# EAGLE design qi_pad (EAGLE 9.3.0)
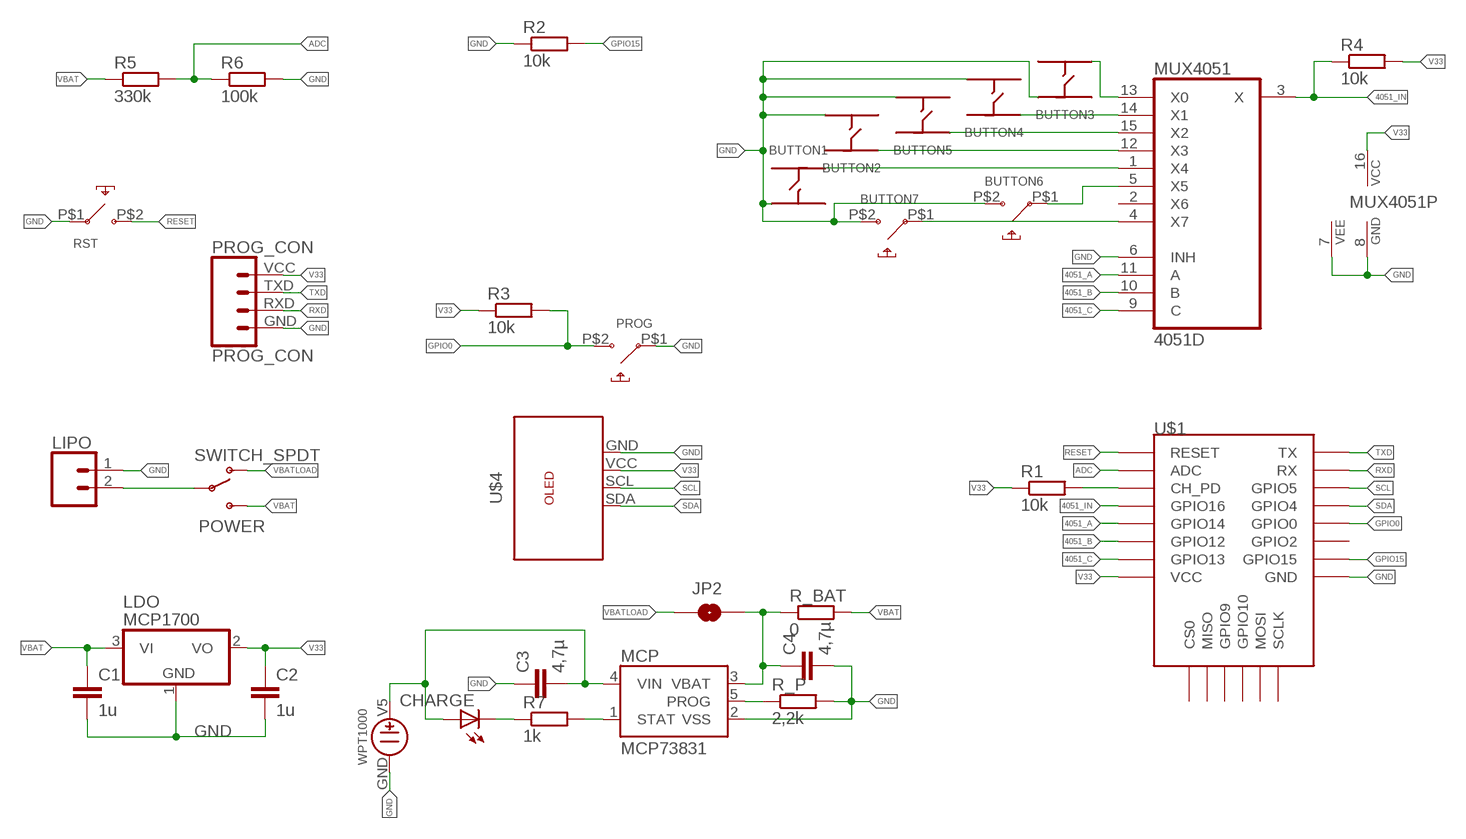
[diagram p0: schematic, sheet 1]

## Parts
BUTTON1  6X6BUTTON  [6X6BUTTON]
BUTTON2  6X6BUTTON  [6X6BUTTON]
BUTTON3  6X6BUTTON  [6X6BUTTON]
BUTTON4  6X6BUTTON  [6X6BUTTON]
BUTTON5  6X6BUTTON  [6X6BUTTON]
BUTTON6  3X4_SMD_BUTTON  [3X4BUTTON]
BUTTON7  3X4_SMD_BUTTON  [3X4BUTTON]
C1  1u  C-EUC1206  [C1206]
C2  1u  C-EUC1206  [C1206]
C3  4,7µ  C-EUC1206  [C1206]
C4  4,7µ  C-EUC1206  [C1206]
CHARGE  LEDCHIPLED_1206  [CHIPLED_1206]
JP2  JUMPER-SMT_2_NO_NO-SILK  [SMT-JUMPER_2_NO_NO-SILK]
LDO  MCP1700  MCP1703CB  [SOT23]
LIPO  CONN_02-JST-2MM-SMT  [JST-2-SMD]
MCP  MCP73831  [SOT23-5]
MUX4051  4051D  [SO16]
POWER  SWITCH_SPDT  [KPS-1290]
PROG  3X6X3,5BUTTON90  [3X6X3,5BUTTON90]
PROG_CON  PROG_CON  [PROG_CON]
R1  10k  R-EU_R0603  [R0603]
R2  10k  R-EU_R0603  [R0603]
R3  10k  R-EU_R0603  [R0603]
R4  10k  R-EU_R0603  [R0603]
R5  330k  R-EU_R0603  [R0603]
R6  100k  R-EU_R0603  [R0603]
R7  1k  R-EU_R0603  [R0603]
R_BAT  0  R-EU_R1206  [R1206]
R_P  2,2k  R-EU_R0603  [R0603]
RST  3X6X3,5BUTTON90  [3X6X3,5BUTTON90]
U$1  ESP8266-12F-SMD  [ESP8266-12F]
U$4  OLED128X64  [OLED_128X64]
WPM1000  WPT1000  [WPT1000]

## Nets
4051_A: MUX4051.11(A) U$1.GPIO14
4051_B: MUX4051.10(B) U$1.GPIO12
4051_C: MUX4051.9(C) U$1.GPIO13
4051_IN: MUX4051.3(X) R4.1 U$1.GPIO16
ADC: R5.2 R6.1 U$1.ADC
GND: BUTTON1.P1(A1) BUTTON2.P2(A2) BUTTON3.P4(U2) BUTTON4.P2(A2) BUTTON5.P2(A2) BUTTON6.P$2(P2) BUTTON7.P$2(P2) C1.2 C2.2 C3.1 C4.2 LDO.1(GND) LIPO.1 MCP.2(VSS) MUX4051.6(INH) MUX4051.7(VEE) MUX4051.8(GND) PROG.P$1(P1) PROG_CON.GND R2.1 R6.2 R_P.2 RST.P$1(P1) U$1.GND U$4.GND WPM1000.GND
GPIO0: PROG.P$2(P2) R3.2 U$1.GPIO0
GPIO15: R2.2 U$1.GPIO15
N$1: BUTTON3.P1(A1) MUX4051.13(X0)
N$2: LIPO.2 POWER.P
N$3: BUTTON6.P$1(P1) MUX4051.5(X5)
N$4: MCP.1(STAT) R7.2
N$5: R1.2 U$1.EN(CH_PD)
N$6: BUTTON7.P$1(P1) MUX4051.4(X7)
N$7: BUTTON1.P4(U2) MUX4051.1(X4)
N$8: MCP.5(PROG) R_P.1
N$9: BUTTON2.P3(U1) MUX4051.12(X3)
N$10: CHARGE.C R7.1
N$11: BUTTON5.P3(U1) MUX4051.15(X2)
N$12: BUTTON4.P3(U1) MUX4051.14(X1)
N$15: C4.1 JP2.2 MCP.3(VBAT) R_BAT.1
RESET: RST.P$2(P2) U$1.RESET
RXD: PROG_CON.RXD U$1.RXD(RX)
SCL: U$1.GPIO5 U$4.SCL
SDA: U$1.GPIO4 U$4.SDA
TXD: PROG_CON.TXD U$1.TXD(TX)
V5: C3.2 CHARGE.A MCP.4(VIN) WPM1000.V5
V33: C2.1 LDO.2(VO) MUX4051.16(VCC) PROG_CON.VCC R1.1 R3.1 R4.2 U$1.VCC U$4.VCC
VBAT: C1.1 LDO.3(VI) POWER.S R5.1 R_BAT.2
VBATLOAD: JP2.1 POWER.O
Unconnected: BUTTON1.P2(A2) BUTTON1.P3(U1) BUTTON2.P1(A1) BUTTON2.P4(U2) BUTTON3.P2(A2) BUTTON3.P3(U1) BUTTON4.P1(A1) BUTTON4.P4(U2) BUTTON5.P1(A1) BUTTON5.P4(U2) MUX4051.2(X6) U$1.CS0 U$1.GPIO2 U$1.GPIO9 U$1.GPIO10 U$1.MISO U$1.MOSI U$1.SCLK

## Library data of the parts
BUTTON1-BUTTON5 = moekoe:6X6BUTTON
BUTTON6 BUTTON7 = moekoe:3X4_SMD_BUTTON
C1-C4 = rcl:C-EU: CAPACITOR, European symbol; SPICEPREFIX: C
CHARGE = adafruit:LED: LED OSRAM: - CHIPLED LG R971, LG N971, LY N971, LG Q971, LY Q971, LO R971, LY R971 LH N974, LH R974 LS Q976, LO Q976, LY Q976 LO Q996 - Hyper CHIPLED LW Q18S LB Q993, LB Q99A, LB R99A - SideLED LS A670, LO A670, LY A670, LG A670, LP A670 LB A673, LV A673, LT A673, LW A673 LH A674 LY A675 LS A676, LA A676, LO A676, LY A676, LW A676 LS A679, LY A679, LG A679 - Hyper Micro SIDELED® LS Y876, LA Y876, LO Y876, LY Y876 LT Y87S - SmartLED LW L88C, LW L88S LB L89C, LB L89S, LG L890 LS L89K, LO L89K, LY L89K LS L896, LA L896, LO L896, LY L896 - TOPLED LS T670, LO T670, LY T670, LG T670, LP T670 LSG T670, LSP T670, LSY T670, LOP T670, LYG T670 LG T671, LOG T671, LSG T671 LB T673, LV T673, LT T673, LW T673 LH T674 LS T676, LA T676, LO T676, LY T676, LB T676, LH T676, LSB T676, LW T676 LB T67C, LV T67C, LT T67C, LS T67K, LO T67K, LY T67K, LW E67C LS E67B, LA E67B, LO E67B, LY E67B, LB E67C, LV E67C, LT E67C LW T67C LS T679, LY T679, LG T679 LS T770, LO T770, LY T770, LG T770, LP T770 LB T773, LV T773, LT T773, LW T773 LH T774 LS E675, LA E675, LY E675, LS T675 LS T776, LA T776, LO T776, LY T776, LB T776 LHGB T686 LT T68C, LB T68C - Hyper Mini TOPLED® LB M676 - Mini TOPLED Santana® LG M470 LS M47K, LO M47K, LY M47K Source: http://www.osram.convergy.de/
JP2 = SparkFun-Jumpers:JUMPER-SMT_2_NO: Normally open jumper This jumper has two pads in close proximity to each other. Apply solder to close the connection. Round pads are easier to solder for beginners, but are a lot larger. SparkFun Product that uses the round pads: SparkFun EL Sequencer <https://www.sparkfun.com/products/12781>
LDO = linear:MCP1703: 250 mA, 16V, Low Quiescent Current LDO Regulator Source: http://ww1.microchip.com/downloads/en/DeviceDoc/22049b.pdf
LIPO = SparkFun-Connectors:CONN_02: Multi connection point. Often used as Generic Header-pin footprint for 0.1 inch spaced/style header connections On any of the 0.1 inch spaced packages, you can populate with these: Break Away Headers - Straight <https://www.sparkfun.com/products/116> (PRT-00116) Break Away Male Headers - Right Angle <https://www.sparkfun.com/products/553> (PRT-00553) Female Headers <https://www.sparkfun.com/products/115> (PRT-00115) Break Away Headers - Machine Pin <https://www.sparkfun.com/products/117> (PRT-00117) Break Away Female Headers - Swiss Machine Pin <https://www.sparkfun.com/products/743> (PRT-00743) For SCREWTERMINALS and SPRING TERMINALS visit here: Screw Terimnals on SparkFun.com <https://www.sparkfun.com/search/results?term=Screw+Terminals> (5mm/3.5mm/2.54mm spacing) This device is also useful as a general connection point to wire up your design to another part of your project. Our various solder wires solder well into these plated through hole pads. Hook-Up Wire - Assortment (Stranded, 22 AWG) <https://www.sparkfun.com/products/11375> (PRT-11375) Hook-Up Wire - Assortment (Solid Core, 22 AWG) <https://www.sparkfun.com/products/11367> (PRT-11367) View the entire wire category on our website here <https://www.sparkfun.com/categories/141> Special notes: Molex polarized connector foot print use with: PRT-08233 with associated crimp pins and housings. 2.54_SCREWTERM for use with PRT-10571. 3.5mm Screw Terminal footprints for PRT-08084 5mm Screw Terminal footprints for use with PRT-08432; PROD_ID: CONN-11443
MCP = SparkFun-IC-Power:MCP73831: MCP73831T Li-Ion, Li-Pol Controller Miniature single cell, fully integrated Li-Ion, Li-polymer charge management controller Datasheet <http://ww1.microchip.com/downloads/en/DeviceDoc/20001984g.pdf> SparkFun Products: SparkFun ESP32 Thing <https://www.sparkfun.com/products/13907> SparkFun 9DoF Razor IMU M0 <https://www.sparkfun.com/products/14001>; PROD_ID: IC-09995
MUX4051 = 40xx:4051: 8-channel ANALOG MULTIPLEXER
POWER = SparkFun-Retired:SWITCH_SPDT: SWCH-10651 Side-actuated SPDT slide switch, as used on the Arduino Pro; PROD_ID: SWCH-10651
PROG RST = moekoe:3X6X3,5BUTTON90
PROG_CON = moekoe:PROG_CON
R1-R7 R_BAT R_P = rcl:R-EU_: RESISTOR, European symbol; SPICEPREFIX: R
U$1 = moekoe:ESP8266-12F-SMD
U$4 = moekoe:OLED128X64
WPM1000 = moekoe:WPT1000

## Board
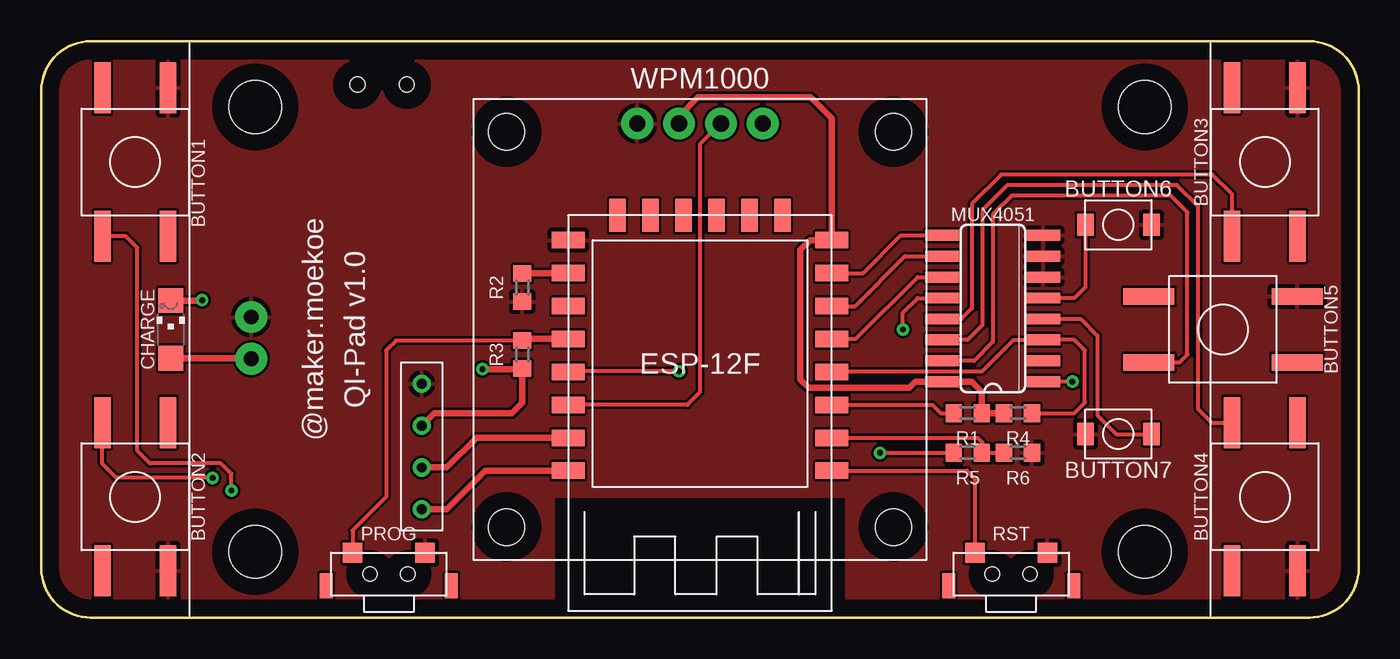
[diagram p1: board, top side]
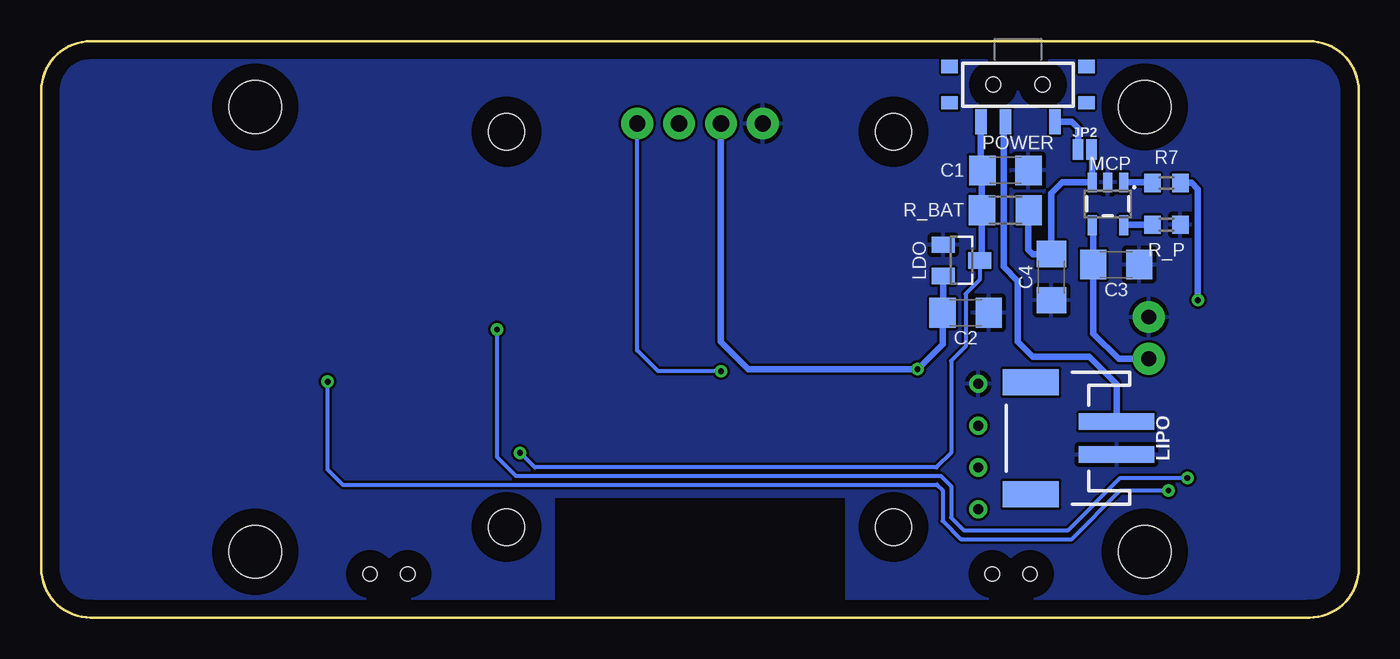
[diagram p2: board, bottom side, seen from below]

Size 80 x 35 mm. Coordinates in mm from the lower left corner, seen from the top.
Outline: 3,35 77,35 arc-90 80,32 80,3 arc-90 77,0 3,0 arc-90 0,3 0,32 arc-90 3,35
Copper layers (1*16): Top 0.035mm / dielectric 1.5mm / Bottom 0.035mm
Design rules "default": minimum track width 6mil, minimum drill 0.35mm, track to track 6mil, track to pad 6mil, pad to pad 6mil, via to via 6mil, smd to smd 6mil, copper to edge 40mil, drill to drill 6mil, minimum pad ring 10mil, minimum via ring 8mil, stop-mask expansion 4mil, vias tented up to drill 0mil, thermal gap 10mil

### Footprints (pad centres in the part's own frame; a part is rotated, then mirrored left to right if it is on the bottom)
6X6BUTTON = smd 3.1 x 1: P1 -4.5,2; P2 4.5,2; P3 -4.5,-2; P4 4.5,-2
3X4BUTTON = smd 1 x 1.35: P$1 -2,0; P$2 2,0
C1206 = smd 1.6 x 1.8: 1 -1.4,0; 2 1.4,0
CHIPLED_1206 = smd 1.5 x 1.5: A 0,-1.75; C 0,1.75
SMT-JUMPER_2_NO_NO-SILK = smd 0.635 x 1.27: 1 -0.406,0; 2 0.406,0
SOT23 = smd 1 x 1.4: 1 -0.95,-1.1; 2 0.95,-1.1; 3 0,1.1
JST-2-SMD = smd 1 x 4.6: 1 -1,-3.7; 2 1,-3.7 | smd 1.6 x 3.4: NC1 -3.4,1.5; NC2 3.4,1.5
SOT23-5 = smd 0.55 x 1.2: 1 -0.95,-1.3; 2 0,-1.3; 3 0.95,-1.3; 4 0.95,1.3; 5 -0.95,1.3
SO16 = smd 0.66 x 2.032: 1 -4.445,-3.073; 2 -3.175,-3.073; 3 -1.905,-3.073; 4 -0.635,-3.073; 5 0.635,-3.073; 6 1.905,-3.073; 7 3.175,-3.073; 8 4.445,-3.073; 9 4.445,3.073; 10 3.175,3.073; 11 1.905,3.073; 12 0.635,3.073; 13 -0.635,3.073; 14 -1.905,3.073; 15 -3.175,3.073; 16 -4.445,3.073
KPS-1290 = smd 0.7 x 1.5: O -2.25,2.25; P 0.75,2.25; S 2.25,2.25 | smd 1 x 0.8: P$1 -4.15,1.1; P$2 -4.15,-1.1; P$3 4.15,-1.1; P$4 4.15,1.1 | hole 0.9: -1.5,0; 1.5,0
3X6X3,5BUTTON90 = smd 1.2 x 1.2: P$1 -2.2,-1.3; P$2 2.2,-1.3 | smd 0.8 x 1.5: P$3 -3.8,0.7; P$4 3.8,0.7 | hole 0.85: -1.15,0; 1.15,0
PROG_CON = drill 0.6: GND 3.81,0; RXD -1.27,0; TXD -3.81,0; VCC 1.27,0
R0603 = smd 1 x 1.1: 1 -0.85,0; 2 0.85,0
R1206 = smd 1.6 x 1.803: 1 -1.422,0; 2 1.422,0
ESP8266-12F = smd 2 x 1: ADC -8,1.5; EN -8,-0.5; GND 8,-10.5; GPIO0 8,-4.5; GPIO2 8,-6.5; GPIO4 8,-2.5; GPIO5 8,-0.5; GPIO12 -8,-6.5; GPIO13 -8,-8.5; GPIO14 -8,-4.5; GPIO15 8,-8.5; GPIO16 -8,-2.5; RESET -8,3.5; RXD 8,1.5; TXD 8,3.5; VCC -8,-10.5 | smd 1 x 2: CS0 -5,-12; GPIO9 -1,-12; GPIO10 1,-12; MISO -3,-12; MOSI 3,-12; SCLK 5,-12
OLED_128X64 = drill 1 pad 1.93: GND -3.81,12.5; SCL 1.27,12.5; SDA 3.81,12.5; VCC -1.27,12.5 | hole 2.2: -11.75,12; 11.75,12; 11.75,-12; -11.75,-12
WPT1000 = drill 0.9 pad 1.93: GND -27.25,0.75; V5 -27.25,-1.79 | hole 3.2: -27,13.5; -27,-13.5; 27,13.5; 27,-13.5

### Placement (x,y rotation side)
BUTTON1  5.71,27.66 270 top
BUTTON2  5.71,7.34 270 top
BUTTON3  74.29,27.66 90 top
BUTTON4  74.29,7.34 270 top
BUTTON5  71.75,17.5 0 top
BUTTON6  65.4,23.85 0 top
BUTTON7  65.4,11.15 180 top
C1  21.46,27.15 0 bottom
C2  23.87,18.52 0 bottom
C3  14.73,21.44 180 bottom
C4  18.66,20.68 270 bottom
CHARGE  7.87,17.5 0 top
JP2  16.63,28.42 0 bottom
LDO  24.12,21.69 270 bottom
LIPO  18.41,10.9 90 bottom
MCP  15.23,25.12 180 bottom
MUX4051  57.78,18.77 90 top
POWER  20.7,32.36 180 bottom
PROG  21.11,2.64 180 top
PROG_CON  23.11,10.39 90 top
R1  56.26,12.42 180 top
R2  29.2,20.04 90 top
R3  29.2,15.98 90 top
R4  59.3,12.42 180 top
R5  56.26,10.01 0 top
R6  59.3,10.01 0 top
R7  11.68,26.39 180 bottom
R_BAT  21.46,24.74 180 bottom
R_P  11.68,23.85 0 bottom
RST  58.89,2.64 180 top
U$1  40,12.42 180 top
U$4  40,17.5 0 top
WPM1000  40,17.5 0 top

### Tracks (layer width: path | path; a pad name or v marks a point on that pad's centre or on a via)
4051_A
  Top 0.254: U$1.GPIO14 49.45,16.92 53.21,20.68 MUX4051.11
4051_B
  Top 0.254: U$1.GPIO12 49.42,18.92 52.45,21.95 MUX4051.10
4051_C
  Top 0.254: U$1.GPIO13 49.9,20.92 52.19,23.21 MUX4051.9
4051_IN
  Top 0.254: R4.1 62.73,12.42 63.37,13.05 63.37,16.23 62.73,16.86 MUX4051.3 59.05,16.86 57.14,14.96 48.04,14.96 U$1.GPIO16
ADC
  Top 0.254: U$1.ADC 56.87,10.92 57.14,10.64 57.11,10.6 R5.2 R6.1
GND
  pour Top: -1.91,36.55 81.91,36.55 81.91,-1.55 48.89,-1.55 48.89,7.34 31.11,7.34 31.11,-1.55 -1.91,-1.55
  pour Bottom: -1.91,36.55 81.91,36.55 81.91,-1.55 48.89,-1.55 48.89,7.34 31.11,7.34 31.11,-1.55 -1.91,-1.55
GPIO0
  Top 0.254: R3.2 21.55,16.83 20.95,16.23 20.95,7.34 18.91,5.3 PROG.P$2
  Top 0.406: U$1.GPIO0 29.3,16.92 R3.2
GPIO15
  Top 0.406: R2.2 29.23,20.92 U$1.GPIO15
N$1
  Top 0.254: BUTTON3.P1 72.29,25.72 71.11,26.9 58.29,26.9 56.51,25.12 56.51,18.77 55.88,18.14 MUX4051.13
N$2
  Bottom 0.406: POWER.P 21.57,29.98 21.57,21.3 20.7,20.42 20.7,16.74 19.81,15.85 16.38,15.85 14.71,14.18 LIPO.2
N$3
  Top 0.254: BUTTON6.P$1 63.4,20.07 62.73,19.41 MUX4051.5
N$4
  Bottom 0.406: R7.2 12.56,26.42 MCP.1
N$5
  Top 0.254: U$1.EN 54.11,12.92 54.61,12.42 R1.2
N$6
  Top 0.254: MUX4051.4 63.11,18.14 64.13,17.12 64.13,12.29 65.27,11.15 BUTTON7.P$1
N$7  (via drill 0.35)
  Top 0.254: BUTTON1.P4 5.13,23.16 5.84,22.45 5.84,10.13 6.6,9.37 10.92,9.37 11.55,8.74 v11.55,7.72 | v62.61,14.32 MUX4051.1
  Bottom 0.254: v62.61,14.32 62.61,8.99 61.69,8.08 25.62,8.08 25.27,7.72 25.27,5.88 24.17,4.78 17.42,4.78 14.47,7.72 v11.55,7.72
N$8
  Bottom 0.406: R_P.1 14.25,23.85 MCP.5
N$9  (via drill 0.35)
  Top 0.254: v52.32,17.5 52.32,18.52 53.21,19.41 MUX4051.12 | v10.41,8.48 4.57,8.48 3.71,9.34 BUTTON2.P3
  Bottom 0.254: v52.32,17.5 52.32,9.75 51.18,8.61 25.39,8.61 24.76,7.97 24.76,6.07 24,5.31 17.65,5.31 14.47,8.48 v10.41,8.48
N$10  (via drill 0.35)
  Top 0.406: v9.77,19.28 9.75,19.25 CHARGE.C
  Bottom 0.406: R7.1 10.16,26.39 9.77,26.01 v9.77,19.28
N$11
  Top 0.254: MUX4051.15 56.64,15.6 57.78,16.74 57.78,24.48 58.92,25.63 68.58,25.63 69.59,24.61 69.59,15.98 69.11,15.5 BUTTON5.P3
N$12
  Top 0.254: BUTTON4.P3 71.06,11.84 70.23,12.67 70.23,24.99 68.96,26.26 58.67,26.26 57.14,24.74 57.14,17.75 56.26,16.86 MUX4051.14
N$15
  Bottom 0.406: R_BAT.1 20.06,24.71 20.06,22.33 19.81,22.07 C4.1 18.66,25.76 18,26.42 MCP.3 16.18,28.38 JP2.2
RESET
  Top 0.254: U$1.RESET 56.2,8.92 56.69,8.43 RST.P$2
RXD
  Top 0.406: U$1.RXD 26.44,10.92 24.63,9.12 PROG_CON.RXD
SCL
  Top 0.254: U$4.SCL 40,28.73 40,13.69 39.23,12.92 U$1.GPIO5
SDA  (via drill 0.35)
  Top 0.254: U$1.GPIO4 32.04,14.96 v38.73,14.96
  Bottom 0.254: v38.73,14.96 42.54,14.96 43.81,16.23 U$4.SDA
TXD
  Top 0.406: U$1.TXD 26.98,8.92 24.63,6.58 PROG_CON.TXD
V5
  Top 0.406: CHARGE.A 12.71,15.75 WPM1000.V5
  Bottom 0.406: MCP.4 16.13,23.76 C3.2 16.13,17.25 14.59,15.71 WPM1000.V5
V33  (via drill 0.35)
  Top 0.406: U$4.VCC 38.73,30.45 39.87,31.6 46.73,31.6 48,30.33 U$1.VCC 46.69,22.92 46.1,22.33 46.1,14.45 46.6,13.94 52.7,13.94 53.08,14.32 MUX4051.16 56.51,14.32 57.11,13.73 R1.1 R4.2 | v26.79,15.09 29.17,15.09 R3.1 29.2,13.05 28.57,12.42 23.87,12.42 PROG_CON.VCC
  Bottom 0.406: U$4.VCC 38.73,16.74 37.08,15.09 v26.79,15.09 25.27,16.61 C2.1 25.23,18.56 LDO.2
VBAT  (via drill 0.35)
  Top 0.254: v50.92,10.01 R5.1
  Bottom 0.254: v50.92,10.01 50.03,9.12 25.65,9.12 24.76,10.01 24.76,15.6 23.87,16.48 23.87,19.66 23.02,20.5 LDO.3
  Bottom 0.406: POWER.S 22.95,27.24 C1.1 22.88,27.13 R_BAT.2 22.88,21.84 LDO.3
VBATLOAD
  Bottom 0.406: POWER.O 17.43,30.11 17.04,29.72 JP2.1

### Text on the board
tNames: @maker.moekoe | QI-Pad v1.0